# EAGLE schematic Analog Drum (EAGLE 9.2.2)
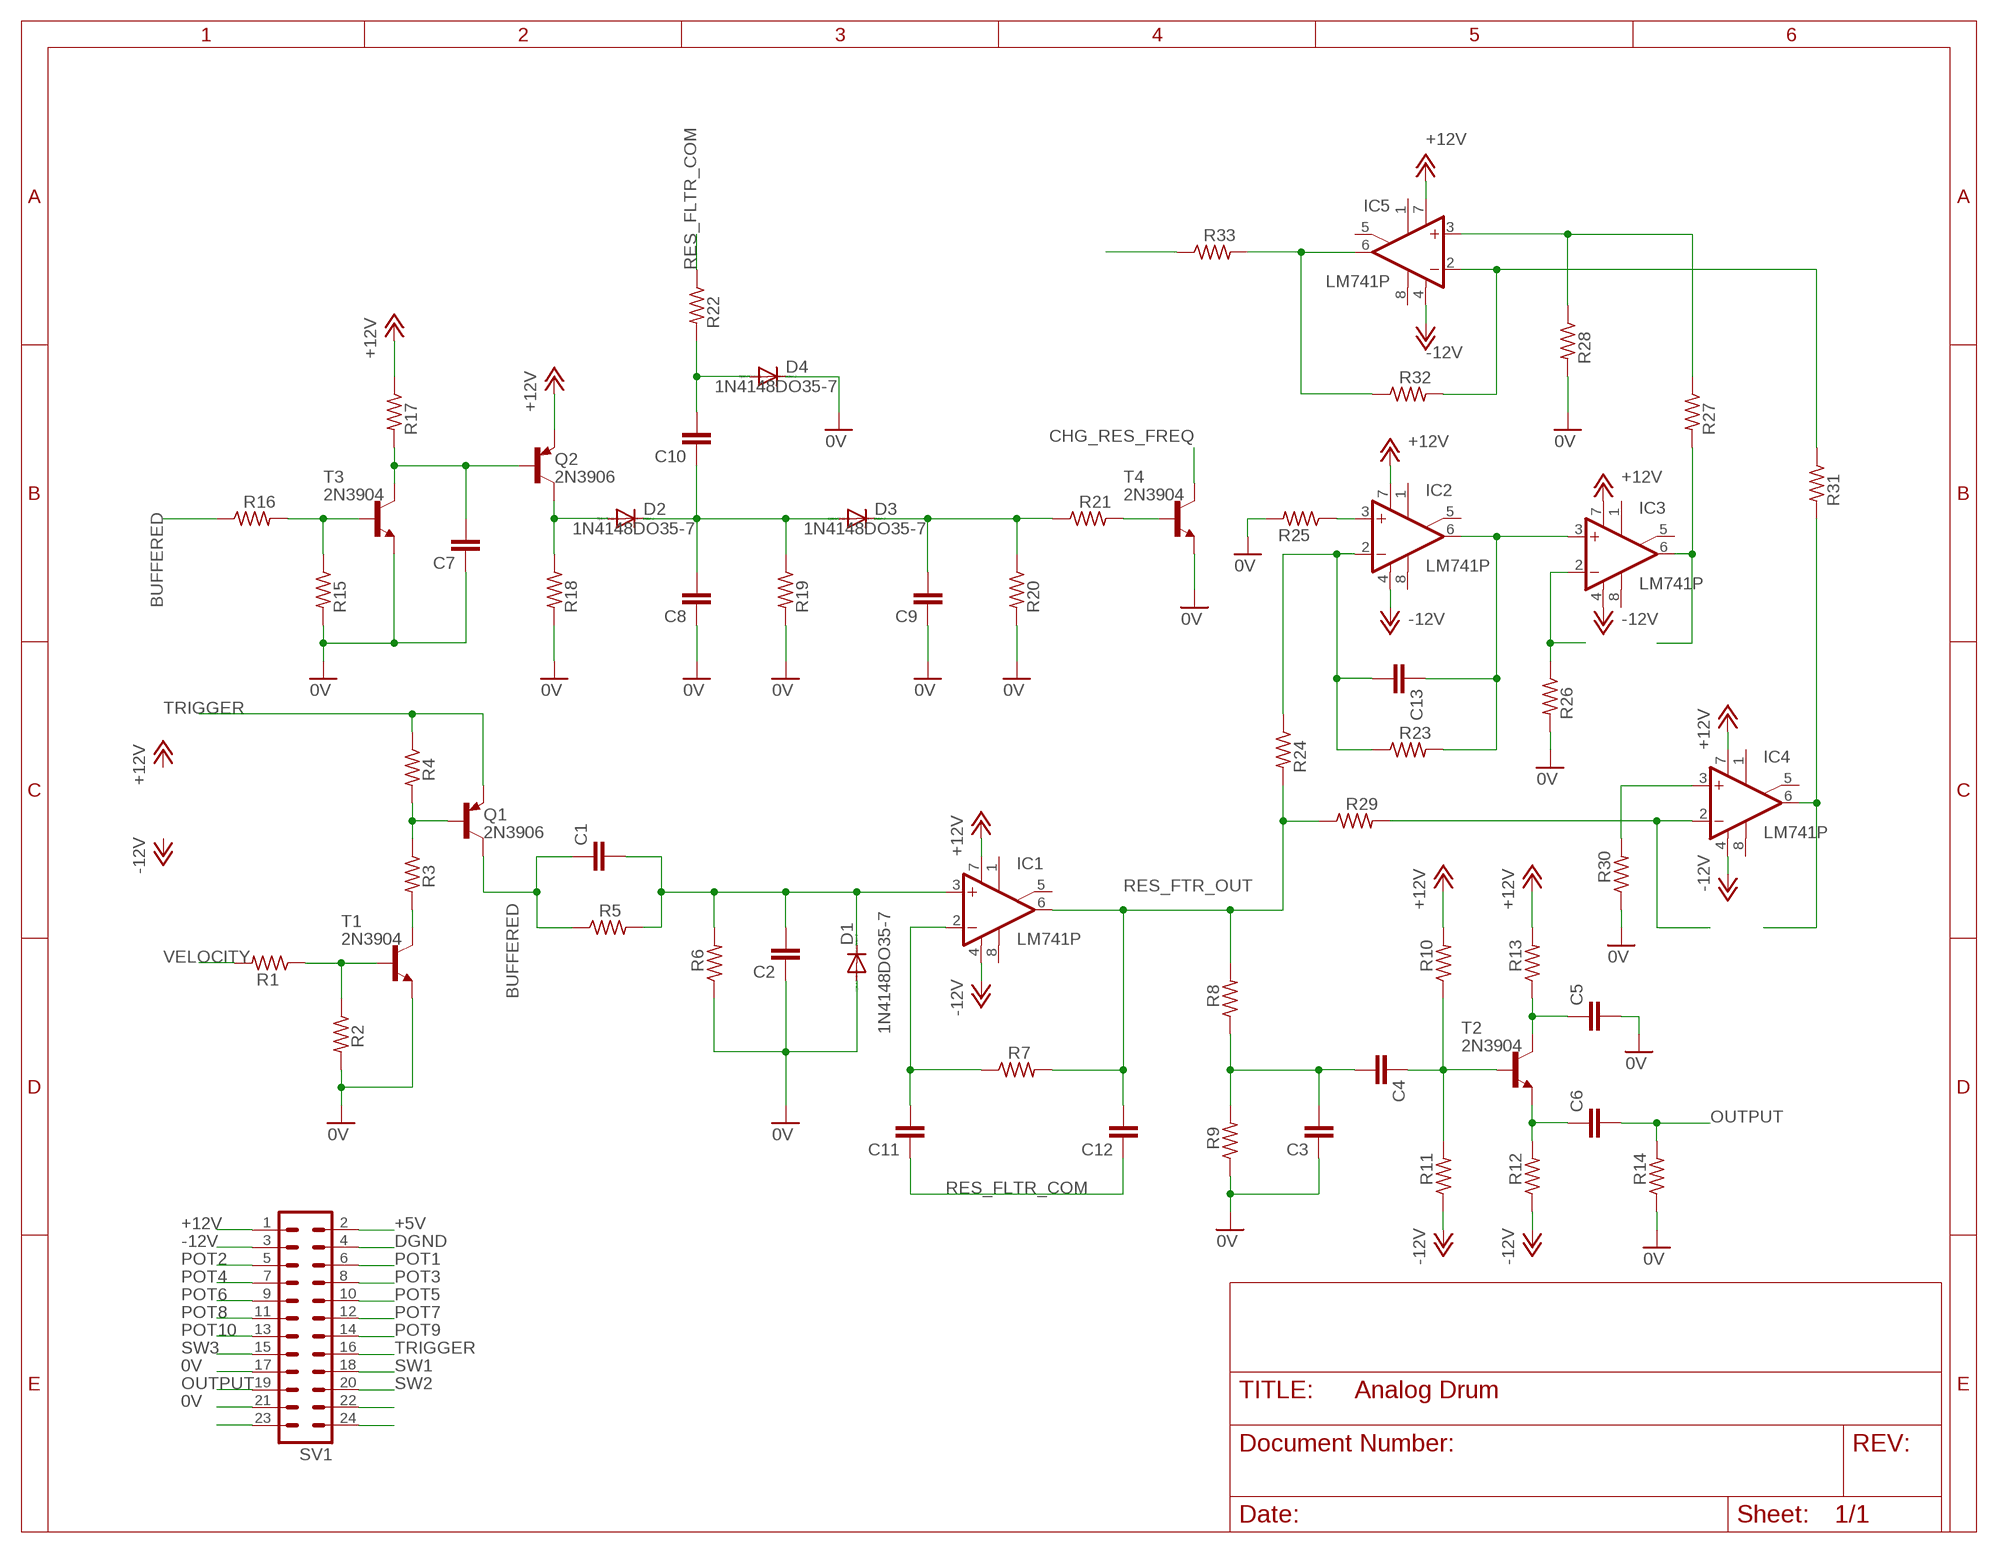
[diagram p0: schematic, sheet 1]

## Parts
C1  C-EU050-024X044  [C050-024X044]
C2  C-EU050-024X044  [C050-024X044]
C3  C-EU050-024X044  [C050-024X044]
C4  C-EU050-024X044  [C050-024X044]
C5  C-EU050-024X044  [C050-024X044]
C6  C-EU050-024X044  [C050-024X044]
C7  C-EU050-024X044  [C050-024X044]
C8  C-EU050-024X044  [C050-024X044]
C9  C-EU050-024X044  [C050-024X044]
C10  C-EU050-024X044  [C050-024X044]
C11  C-EU050-024X044  [C050-024X044]
C12  C-EU050-024X044  [C050-024X044]
C13  C-EU050-024X044  [C050-024X044]
D1  1N4148DO35-7  [DO35-7]
D2  1N4148DO35-7  [DO35-7]
D3  1N4148DO35-7  [DO35-7]
D4  1N4148DO35-7  [DO35-7]
IC1  LM741P  [DIL08]
IC2  LM741P  [DIL08]
IC3  LM741P  [DIL08]
IC4  LM741P  [DIL08]
IC5  LM741P  [DIL08]
Q1  2N3906  [TO92]
Q2  2N3906  [TO92]
R1  R-US_0207/10  [0207/10]
R2  R-US_0207/10  [0207/10]
R3  R-US_0207/10  [0207/10]
R4  R-US_0207/10  [0207/10]
R5  R-US_0207/10  [0207/10]
R6  R-US_0207/10  [0207/10]
R7  R-US_0207/10  [0207/10]
R8  R-US_0207/10  [0207/10]
R9  R-US_0207/10  [0207/10]
R10  R-US_0207/10  [0207/10]
R11  R-US_0207/10  [0207/10]
R12  R-US_0207/10  [0207/10]
R13  R-US_0207/10  [0207/10]
R14  R-US_0207/10  [0207/10]
R15  R-US_0207/10  [0207/10]
R16  R-US_0207/10  [0207/10]
R17  R-US_0207/10  [0207/10]
R18  R-US_0207/10  [0207/10]
R19  R-US_0207/10  [0207/10]
R20  R-US_0207/10  [0207/10]
R21  R-US_0207/10  [0207/10]
R22  R-US_0207/10  [0207/10]
R23  R-US_0207/10  [0207/10]
R24  R-US_0207/10  [0207/10]
R25  R-US_0207/10  [0207/10]
R26  R-US_0207/10  [0207/10]
R27  R-US_0207/10  [0207/10]
R28  R-US_0207/10  [0207/10]
R29  R-US_0207/10  [0207/10]
R30  R-US_0207/10  [0207/10]
R31  R-US_0207/10  [0207/10]
R32  R-US_0207/10  [0207/10]
R33  R-US_0207/10  [0207/10]
SV1  MA12-2  [MA12-2]
T1  2N3904  [TO92]
T2  2N3904  [TO92]
T3  2N3904  [TO92]
T4  2N3904  [TO92]

## Nets
0V: C2.1 C3.1 C5.2 C7.1 C8.1 C9.1 D1.A D4.C R2.2 R6.1 R9.1 R14.1 R15.2 R18.2 R19.2 R20.2 R25.2 R26.2 R28.2 R30.1 SV1.17 SV1.21 T1.3(E) T3.3(E) T4.3(E)
+5V: SV1.2
+12V: IC1.7(V+) IC2.7(V+) IC3.7(V+) IC4.7(V+) IC5.7(V+) Q2.3(E) R10.2 R13.2 R17.1 SV1.1
-12V: IC1.4(V-) IC2.4(V-) IC3.4(V-) IC4.4(V-) IC5.4(V-) R11.1 R12.1 SV1.3
BUFFERED: C1.1 Q1.1(C) R5.1 R16.1
CHG_RES_FREQ: T4.1(C)
DGND: SV1.4
N$1: R1.1 R2.1 T1.2(B)
N$2: R3.2 T1.1(C)
N$3: Q1.2(B) R3.1 R4.2
N$4: C10.2 D4.A R22.2
N$5: C1.2 C2.2 D1.C IC1.3(+IN) R5.2 R6.2
N$6: C11.2 IC1.2(-IN) R7.1
N$7: IC2.3(+IN) R25.1
N$8: C3.2 C4.2 R8.1 R9.2
N$9: C4.1 R10.1 R11.2 T2.2(B)
N$10: C6.1 R12.2 T2.3(E)
N$11: C5.1 R13.1 T2.1(C)
N$12: C13.2 IC2.2(-IN) R23.1 R24.1
N$13: R15.1 R16.2 T3.2(B)
N$14: C7.2 Q2.2(B) R17.2 T3.1(C)
N$15: D2.A Q2.1(C) R18.1
N$16: C8.2 C10.1 D2.C D3.A R19.1
N$17: C9.2 D3.C R20.1 R21.1
N$18: R21.2 T4.2(B)
N$19: C13.1 IC2.6(OUT) IC3.3(+IN) R23.2
N$20: IC3.2(-IN) R26.1
N$21: IC3.6(OUT) R27.2
N$22: IC5.3(+IN) R27.1 R28.1
N$23: IC4.2(-IN) R29.2
N$24: SV1.23
N$25: SV1.24
N$26: SV1.22
N$27: IC4.3(+IN) R30.2
N$28: IC4.6(OUT) R31.2
N$29: IC5.2(-IN) R31.1 R32.2
N$31: IC5.6(OUT) R32.1 R33.2
N$32: R33.1
OUTPUT: C6.2 R14.2 SV1.19
POT1: SV1.6
POT2: SV1.5
POT3: SV1.8
POT4: SV1.7
POT5: SV1.10
POT6: SV1.9
POT7: SV1.12
POT8: SV1.11
POT9: SV1.14
POT10: SV1.13
RES_FLTR_COM: C11.1 C12.1 R22.1
RES_FTR_OUT: C12.2 IC1.6(OUT) R7.2 R8.2 R24.2 R29.1
SW1: SV1.18
SW2: SV1.20
SW3: SV1.15
TRIGGER: Q1.3(E) R4.1 SV1.16
VELOCITY: R1.2
Unconnected: IC1.1(ON1) IC1.5(ON2) IC1.8(OPT) IC2.1(ON1) IC2.5(ON2) IC2.8(OPT) IC3.1(ON1) IC3.5(ON2) IC3.8(OPT) IC4.1(ON1) IC4.5(ON2) IC4.8(OPT) IC5.1(ON1) IC5.5(ON2) IC5.8(OPT)

## Library data of the parts
C1-C13 = resistor:C-EU: CAPACITOR, European symbol
D1-D4 = diode:1N4148: DIODE high speed (Philips)
IC1-IC5 = linear:*741: OP AMP
Q1 Q2 = transistor-pnp:2N3906: PNP Transistor
R1-R33 = resistor:R-US_: RESISTOR, American symbol
SV1 = con-lstb:MA12-2: PIN HEADER; OC_FARNELL: unknown; OC_NEWARK: unknown
T1-T4 = transistor:2N3904: NPN TRANSISTOR